# EAGLE design PWMExpansion (EAGLE 6.1)
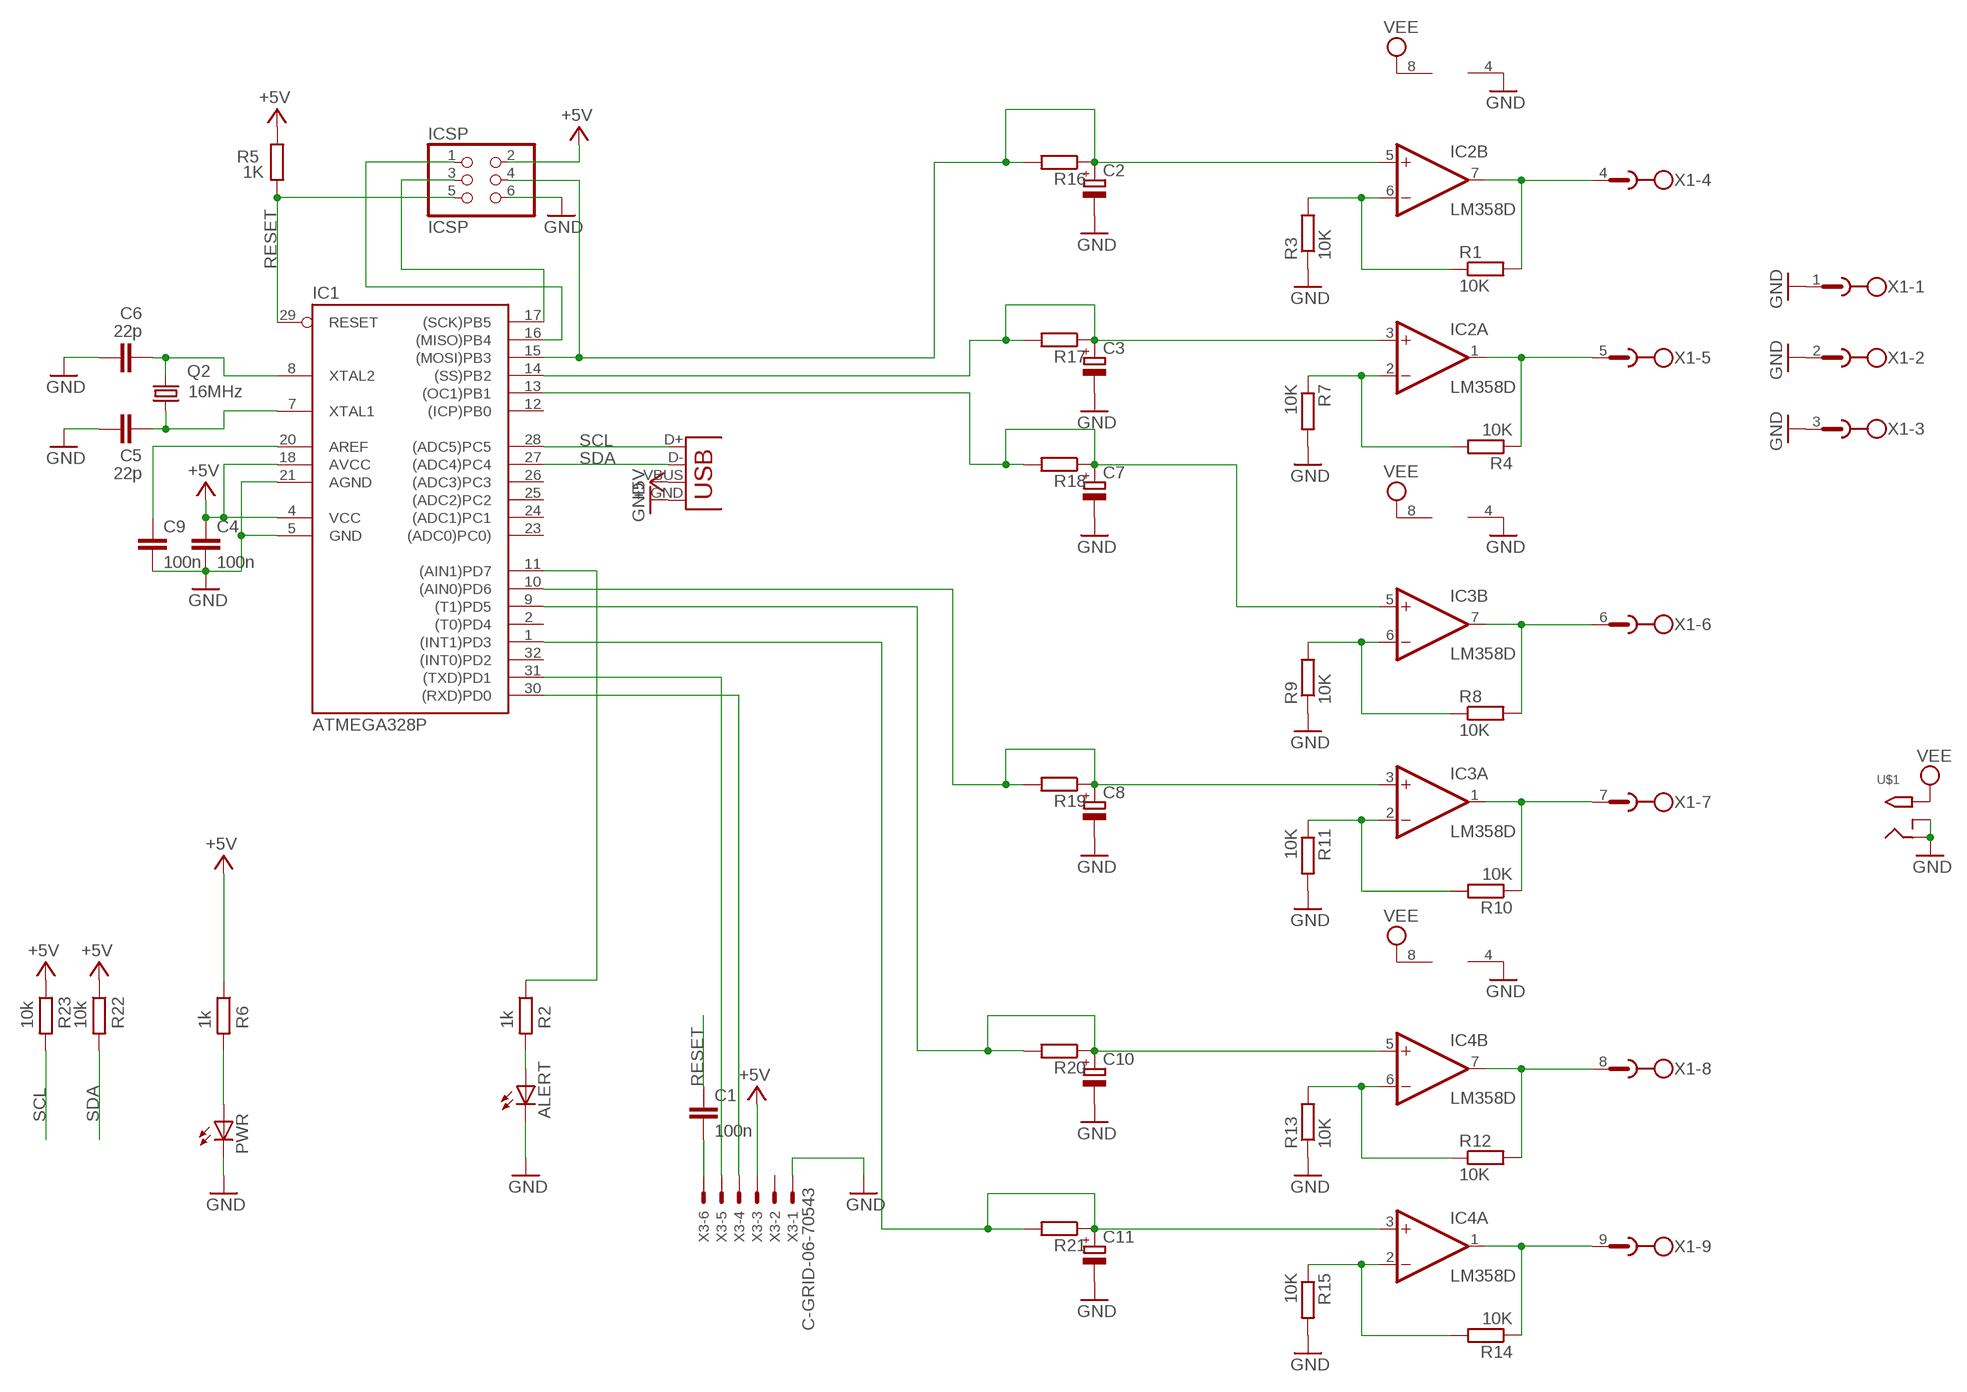
[diagram p0: schematic, sheet 1]

## Parts
ALERT  LED3MM  [LED3MM]
C1  100n  C-EUC0805  [C0805]
C2  CPOL-EUA/3216-18W  [A/3216-18W]
C3  CPOL-EUA/3216-18W  [A/3216-18W]
C4  100n  C-EUC0805  [C0805]
C5  22p  C-EUC0805  [C0805]
C6  22p  C-EUC0805  [C0805]
C7  CPOL-EUA/3216-18W  [A/3216-18W]
C8  CPOL-EUA/3216-18W  [A/3216-18W]
C9  100n  C-EUC0805  [C0805]
C10  CPOL-EUA/3216-18W  [A/3216-18W]
C11  CPOL-EUA/3216-18W  [A/3216-18W]
IC1  ATMEGA328P  AT90S4433A  [TQFP32-08]
IC2  LM358D  [SO08]
IC3  LM358D  [SO08]
IC4  LM358D  [SO08]
ICSP  ICSP  PINHD-2X3  [2X03]
PWR  LED3MM  [LED3MM]
Q2  16MHz  CRYTALHC49S  [HC49/S]
R1  10K  R-EU_R0805  [R0805]
R2  1k  R-EU_R0805  [R0805]
R3  10K  R-EU_R0805  [R0805]
R4  10K  R-EU_R0805  [R0805]
R5  1K  R-EU_R0805  [R0805]
R6  1k  R-EU_R0805  [R0805]
R7  10K  R-EU_R0805  [R0805]
R8  10K  R-EU_R0805  [R0805]
R9  10K  R-EU_R0805  [R0805]
R10  10K  R-EU_R0805  [R0805]
R11  10K  R-EU_R0805  [R0805]
R12  10K  R-EU_R0805  [R0805]
R13  10K  R-EU_R0805  [R0805]
R14  10K  R-EU_R0805  [R0805]
R15  10K  R-EU_R0805  [R0805]
R16  R-EU_R0805  [R0805]
R17  R-EU_R0805  [R0805]
R18  R-EU_R0805  [R0805]
R19  R-EU_R0805  [R0805]
R20  R-EU_R0805  [R0805]
R21  R-EU_R0805  [R0805]
R22  10k  R-EU_R0805  [R0805]
R23  10k  R-EU_R0805  [R0805]
U$1  2.1MMJACKTHM  [PJ-102A]
X1  MSTBV9  [MSTBV9]
X3  C-GRID-06-70543  [70543-06]
X5  USBSMD  [USB-MINIB]

## Nets
+5V: C4.1 IC1.4(VCC) IC1.18(AVCC) ICSP.2 R5.2 R6.1 R22.1 R23.1 X3.3 X5.VBUS
CTS: C1.2 X3.6
GND [gnd]: ALERT.K(C) C2.- C3.- C4.2 C5.1 C6.1 C7.- C8.- C9.2 C10.- C11.- IC1.5(GND) IC1.21(AGND) IC2.4(P:V-) IC3.4(P:V-) IC4.4(P:V-) ICSP.6 PWR.K(C) R3.1 R7.2 R9.1 R11.2 R13.1 R15.2 U$1.RING U$1.RING_SW X1.1 X1.2 X1.3 X3.1 X5.GND
MISO: IC1.16((MISO)PB4) ICSP.1
MOSI: C2.+ IC1.15((MOSI)PB3) IC2.5(B:+IN) ICSP.4 R16.1 R16.2
MOSI1: C7.+ IC1.13((OC1)PB1) IC3.5(B:+IN) R18.1 R18.2
MOSI2: C10.+ IC1.9((T1)PD5) IC4.5(B:+IN) R20.1 R20.2
N$1: C11.+ IC1.1((INT1)PD3) IC4.3(A:+IN) R21.1 R21.2
N$2: C8.+ IC1.10((AIN0)PD6) IC3.3(A:+IN) R19.1 R19.2
N$3: IC4.1(A:OUT) R14.1 X1.9
N$4: IC4.7(B:OUT) R12.2 X1.8
N$5: C3.+ IC1.14((SS)PB2) IC2.3(A:+IN) R17.1 R17.2
N$6: IC3.1(A:OUT) R10.1 X1.7
N$7: C5.2 IC1.7(XTAL1) Q2.1
N$8: IC3.6(B:-IN) R8.1 R9.2
N$9: C6.2 IC1.8(XTAL2) Q2.2
N$10: PWR.A R6.2
N$11: IC1.30((RXD)PD0) X3.4
N$12: IC1.31((TXD)PD1) X3.5
N$13: C9.1 IC1.20(AREF)
N$14: IC3.2(A:-IN) R10.2 R11.1
N$15: IC1.11((AIN1)PD7) R2.1
N$16: IC3.7(B:OUT) R8.2 X1.6
N$17: IC4.6(B:-IN) R12.1 R13.2
N$18: IC4.2(A:-IN) R14.2 R15.1
N$19: IC2.1(A:OUT) R4.1 X1.5
N$20: IC2.7(B:OUT) R1.2 X1.4
N$61: IC2.6(B:-IN) R1.1 R3.2
N$62: IC2.2(A:-IN) R4.2 R7.1
N$63: ALERT.A R2.2
RESET: C1.1 IC1.29(RESET) ICSP.5 R5.1
SCK: IC1.17((SCK)PB5) ICSP.3
SCL: IC1.28((ADC5)PC5) R23.2 X5.D+
SDA: IC1.27((ADC4)PC4) R22.2 X5.D-
VEE: IC2.8(P:V+) IC3.8(P:V+) IC4.8(P:V+) U$1.TIP
Unconnected: IC1.2((T0)PD4) IC1.12((ICP)PB0) IC1.23((ADC0)PC0)) IC1.24((ADC1)PC1) IC1.25((ADC2)PC2) IC1.26((ADC3)PC3) IC1.32((INT0)PD2) X3.2

## Library data of the parts
ALERT PWR = led:LED: LED OSRAM: - CHIPLED LG R971, LG N971, LY N971, LG Q971, LY Q971, LO R971, LY R971 LH N974, LH R974 LS Q976, LO Q976, LY Q976 LO Q996 - Hyper CHIPLED LW Q18S LB Q993, LB Q99A, LB R99A - SideLED LS A670, LO A670, LY A670, LG A670, LP A670 LB A673, LV A673, LT A673, LW A673 LH A674 LY A675 LS A676, LA A676, LO A676, LY A676, LW A676 LS A679, LY A679, LG A679 - Hyper Micro SIDELED® LS Y876, LA Y876, LO Y876, LY Y876 LT Y87S - SmartLED LW L88C, LW L88S LB L89C, LB L89S, LG L890 LS L89K, LO L89K, LY L89K LS L896, LA L896, LO L896, LY L896 - TOPLED LS T670, LO T670, LY T670, LG T670, LP T670 LSG T670, LSP T670, LSY T670, LOP T670, LYG T670 LG T671, LOG T671, LSG T671 LB T673, LV T673, LT T673, LW T673 LH T674 LS T676, LA T676, LO T676, LY T676, LB T676, LH T676, LSB T676, LW T676 LB T67C, LV T67C, LT T67C, LS T67K, LO T67K, LY T67K, LW E67C LS E67B, LA E67B, LO E67B, LY E67B, LB E67C, LV E67C, LT E67C LW T67C LS T679, LY T679, LG T679 LS T770, LO T770, LY T770, LG T770, LP T770 LB T773, LV T773, LT T773, LW T773 LH T774 LS E675, LA E675, LY E675, LS T675 LS T776, LA T776, LO T776, LY T776, LB T776 LHGB T686 LT T68C, LB T68C - Hyper Mini TOPLED® LB M676 - Mini TOPLED Santana® LG M470 LS M47K, LO M47K, LY M47K Source: http://www.osram.convergy.de LUXEON: - LUMILED® LXK2-PW12-R00, LXK2-PW12-S00, LXK2-PW14-U00, LXK2-PW14-V00 LXK2-PM12-R00, LXK2-PM12-S00, LXK2-PM14-U00 LXK2-PE12-Q00, LXK2-PE12-R00, LXK2-PE12-S00, LXK2-PE14-T00, LXK2-PE14-U00 LXK2-PB12-K00, LXK2-PB12-L00, LXK2-PB12-M00, LXK2-PB14-N00, LXK2-PB14-P00, LXK2-PB14-Q00 LXK2-PR12-L00, LXK2-PR12-M00, LXK2-PR14-Q00, LXK2-PR14-R00 LXK2-PD12-Q00, LXK2-PD12-R00, LXK2-PD12-S00 LXK2-PH12-R00, LXK2-PH12-S00 LXK2-PL12-P00, LXK2-PL12-Q00, LXK2-PL12-R00 Source: www.luxeon.com KINGBRIGHT: KA-3528ASYC Source: www.kingbright.com
C1 C4-C6 C9 = rcl:C-EU: CAPACITOR, European symbol
C2 C3 C7 C8 C10 C11 = rcl:CPOL-EU: POLARIZED CAPACITOR, European symbol
IC1 = atmel:AT90S4433: MICROCONTROLLER 4 Kbytes FLASH 128 bytes SRAM 256 bytes EEPROM UART 6-channel 10 bit ADC
IC2-IC4 = linear:LM358: OP AMP also LM158; LM258; LM2904 Source: http://cache.national.com/ds/LM/LM158.pdf
ICSP = pinhead:PINHD-2X3: PIN HEADER
Q2 = crystal:CRYTAL: CRYSTAL
R1-R23 = rcl:R-EU_: RESISTOR, European symbol
U$1 = adafruit:2.1MMJACK: 2.1mm x 5.5mm THM DC jack with internal switch. Digikey part #PJ-102A, 4UCON part #05537 2.1mm x 5.5mm SMT DC jack with internal switch. Digikey part #PJ-002A-SMT, 4UCON part #03267 By microbuilder.eu & adafruit.com
X1 = con-phoenix-508:MSTBV9: PHOENIX
X3 = con-molex:C-GRID-06: CONNECTOR wire to board 2.54 mm (0.100") pitch header
X5 = SparkFun:USB: USB Connectors USB-B-PTH is fully proven SKU : PRT-00139 USB-miniB is fully proven SKU : PRT-00587 USB-A-PCB is untested. USB-A-H is throughly reviewed, but untested. Spark Fun Electronics SKU : PRT-00437 USB-B-SMT is throughly reviewed, but untested. Needs silkscreen touching up. USB-A-S has not been used/tested USB-MB-H has not been used/tested

## Net classes
0 default: width 0.254 mm, drill 0.254 mm, clearance 0.203 mm
1 power: width 0.305 mm, drill 0.305 mm, clearance 0.203 mm
2 gnd: width 0.305 mm, drill 0.508 mm, clearance 0.203 mm

## Board
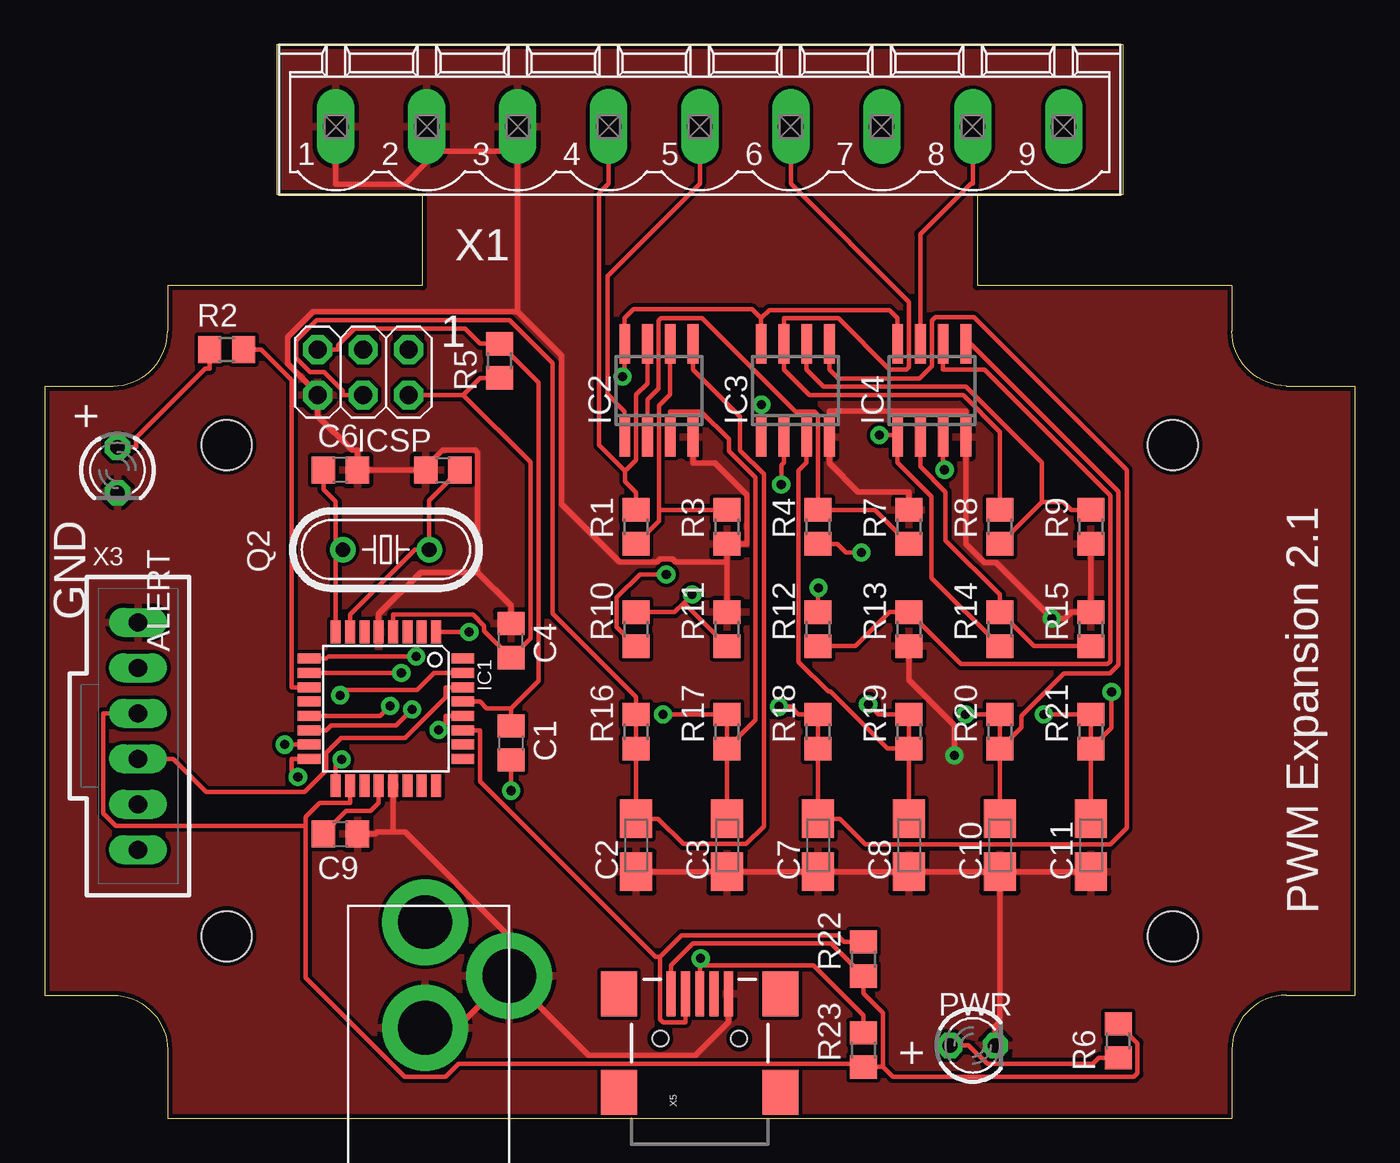
[diagram p1: board, top side]
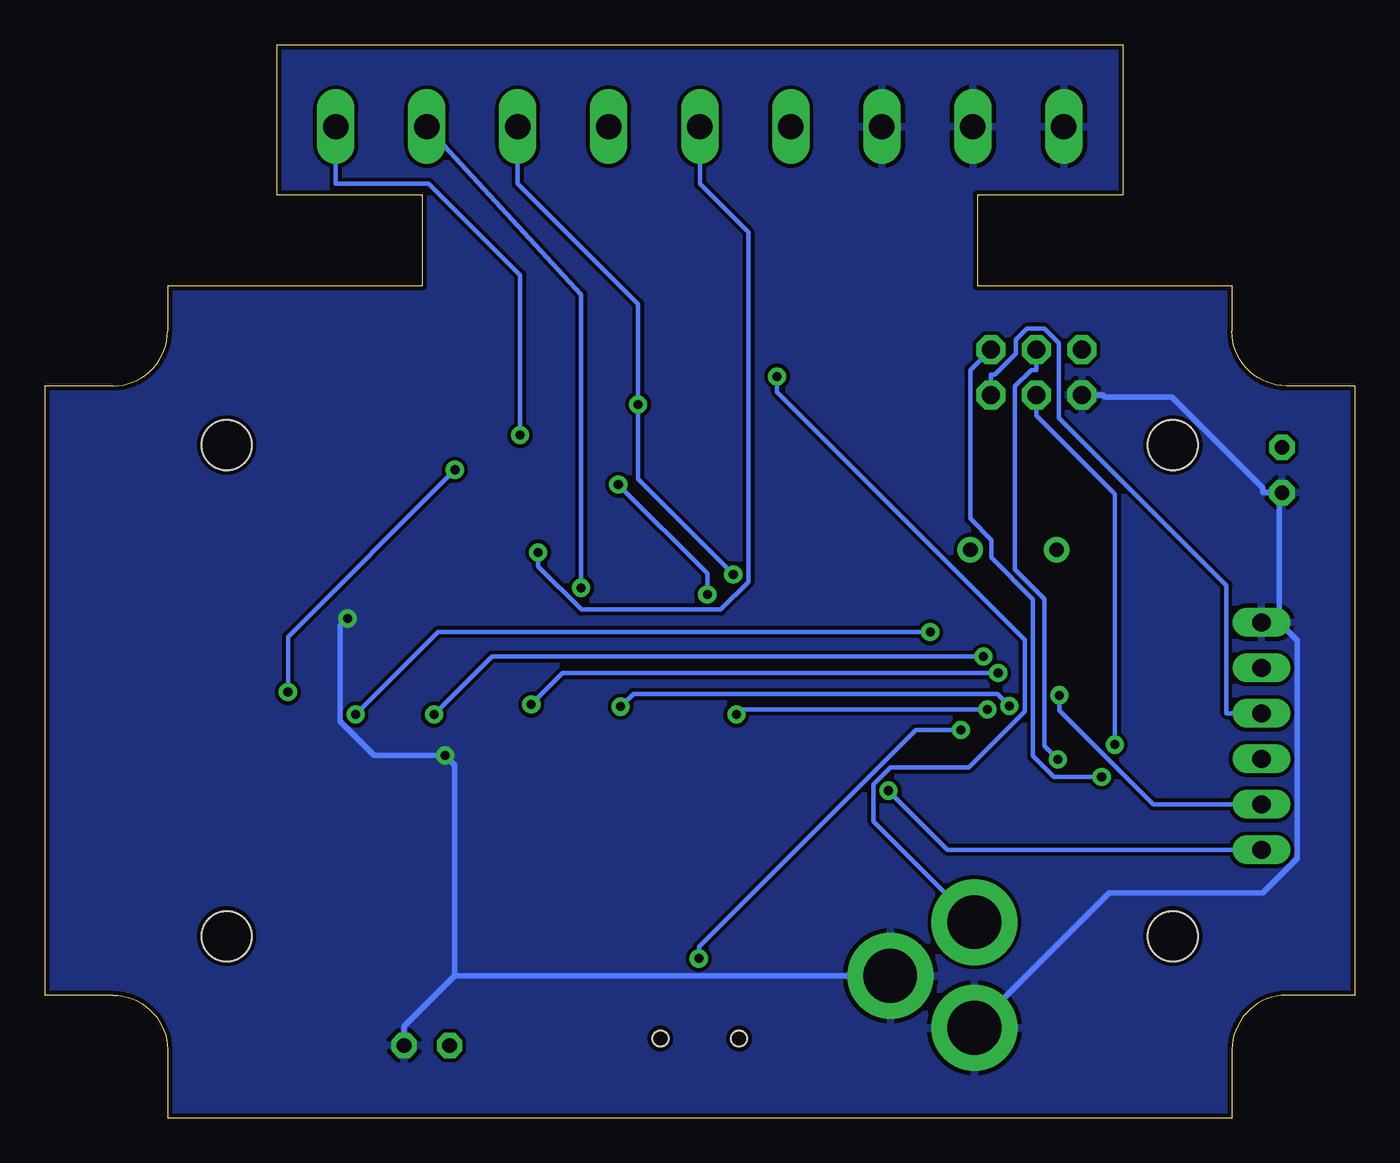
[diagram p2: board, bottom side, seen from below]

Size 73.15 x 59.94 mm. Coordinates in mm from the lower left corner, seen from the top.
Outline: 0,40.89 0,6.86 3.81,6.86 arc-90 6.86,3.81 6.86,0 66.29,0 66.29,3.81 arc-90 69.34,6.86 73.15,6.86 73.15,40.89 69.34,40.89 arc-90 66.29,43.94 66.29,46.48 52.07,46.48 52.07,51.56 60.2,51.56 60.2,59.94 12.95,59.94 12.95,51.56 21.08,51.56 21.08,46.48 6.86,46.48 6.86,43.94 arc-90 3.81,40.89 0,40.89
Copper layers (1*16): Top 0.035mm / dielectric 1.5mm / Bottom 0.035mm
Design rules: minimum track width 8mil, minimum drill 20mil, track to track 8mil, track to pad 8mil, pad to pad 8mil, via to via 8mil, smd to smd 8mil, copper to edge 10mil, drill to drill 8mil, minimum pad ring 12mil, minimum via ring 10mil, stop-mask expansion 4mil, vias tented up to drill 25mil, thermal gap 10mil
Holes 2.8 mm at 62.99,10.16 62.99,37.59 10.16,37.59 10.16,10.16

### Footprints (pad centres in the part's own frame; a part is rotated, then mirrored left to right if it is on the bottom)
LED3MM = drill 0.813 octagon: A -1.27,0; K 1.27,0
C0805 = smd 1.3 x 1.5: 1 -0.95,0; 2 0.95,0
A/3216-18W = smd 2.15 x 1.8: + 1.475,0; - -1.475,0
TQFP32-08 = smd 1.27 x 0.559: 1 -4.293,2.8; 2 -4.293,2; 3 -4.293,1.2; 4 -4.293,0.4; 5 -4.293,-0.4; 6 -4.293,-1.2; 7 -4.293,-2; 8 -4.293,-2.8; 17 4.293,-2.8; 18 4.293,-2; 19 4.293,-1.2; 20 4.293,-0.4; 21 4.293,0.4; 22 4.293,1.2; 23 4.293,2; 24 4.293,2.8 | smd 0.559 x 1.27: 9 -2.8,-4.293; 10 -2,-4.293; 11 -1.2,-4.293; 12 -0.4,-4.293; 13 0.4,-4.293; 14 1.2,-4.293; 15 2,-4.293; 16 2.8,-4.293; 25 2.8,4.293; 26 2,4.293; 27 1.2,4.293; 28 0.4,4.293; 29 -0.4,4.293; 30 -1.2,4.293; 31 -2,4.293; 32 -2.8,4.293
SO08 = smd 0.6 x 2.2: 1 -1.905,-2.6; 2 -0.635,-2.6; 3 0.635,-2.6; 4 1.905,-2.6; 5 1.905,2.6; 6 0.635,2.6; 7 -0.635,2.6; 8 -1.905,2.6
2X03 = drill 1.016 octagon: 1 -2.54,-1.27; 2 -2.54,1.27; 3 0,-1.27; 4 0,1.27; 5 2.54,-1.27; 6 2.54,1.27
HC49/S = drill 0.813: 1 -2.413,0; 2 2.413,0
R0805 = smd 1.3 x 1.5: 1 -0.95,0; 2 0.95,0
PJ-102A = drill 3 pad 4.8: RING 0.1,-3.39; RING_SW -4.6,-6.29; TIP 0.1,-9.29
MSTBV9 = drill 1.397 long: 1 -20.32,0; 2 -15.24,0; 3 -10.16,0; 4 -5.08,0; 5 0,0; 6 5.08,0; 7 10.16,0; 8 15.24,0; 9 20.32,0
70543-06 = drill 1.016 long: 1 -6.35,0; 2 -3.81,0; 3 -1.27,0; 4 1.27,0; 5 3.81,0; 6 6.35,0
USB-MINIB = smd 2.5 x 0.5: D+ 2.5,0; D- 2.5,0.8; GND 2.5,-1.6; ID 2.5,-0.8; VBUS 2.5,1.6 | smd 2.5 x 2: GND@1 -3,-4.5; GND@2 -3,4.5; GND@3 2.5,4.5; GND@4 2.5,-4.5 | hole 0.9: 0,2.2; 0,-2.2

### Placement (x,y rotation side)
ALERT  4.06,36.2 270 top
C1  26.04,20.95 270 top
C2  33.02,15.24 90 top
C3  38.1,15.24 90 top
C4  26.04,26.67 90 top
C5  22.23,36.2 0 top
C6  16.51,36.2 180 top
C7  43.18,15.24 90 top
C8  48.26,15.24 90 top
C9  16.51,15.88 0 top
C10  53.34,15.24 90 top
C11  58.42,15.24 90 top
IC1  19.05,22.86 270 top
IC2  34.29,40.64 0 top
IC3  41.91,40.64 0 top
IC4  49.53,40.64 0 top
ICSP  17.78,41.66 180 top
PWR  51.82,4.06 0 top
Q2  19.05,31.75 180 top
R1  33.02,33.02 90 top
R2  10.16,42.93 180 top
R3  38.1,33.02 90 top
R4  43.18,33.02 90 top
R5  25.4,42.29 270 top
R6  59.94,4.32 270 top
R7  48.26,33.02 90 top
R8  53.34,33.02 90 top
R9  58.42,33.02 90 top
R10  33.02,27.3 90 top
R11  38.1,27.3 90 top
R12  43.18,27.3 90 top
R13  48.26,27.3 90 top
R14  53.34,27.3 90 top
R15  58.42,27.3 90 top
R16  33.02,21.59 90 top
R17  38.1,21.59 90 top
R18  43.18,21.59 90 top
R19  48.26,21.59 90 top
R20  53.34,21.59 90 top
R21  58.42,21.59 90 top
R22  45.72,8.89 90 top
R23  45.72,3.81 90 top
U$1  21.34,1.65 180 top
X1  36.58,55.37 0 top
X3  5.21,21.34 270 top
X5  36.58,4.45 90 top

### Tracks (layer width: path | path; a pad name or v marks a point on that pad's centre or on a via)
+5V
  Top 0.254: X5.VBUS 34.98,8.53 36.2,9.75 43.91,9.75 R22.1 45.72,6.96 46.8,5.88 46.8,2.86 | 23.36,40.39 27.11,36.63 27.11,26.8 C4.1 24.54,27.21 24.54,27.49 23.92,28.12 19.45,28.12 IC1.4 | 23.36,40.39 24.32,41.34 R5.2 | ICSP.2 23.36,40.39 | 14.58,16.33 14.58,7.83 20.11,2.3 22.39,2.3 23.11,3.02 46.09,3.02 46.26,2.86 | 14.58,16.33 14.58,16.83 15.35,17.6 17.05,17.6 IC1.18 | 14.58,16.33 3.95,16.33 3.25,17.03 3.25,22.61 X3.3 | 46.8,2.86 47.36,2.3 60.83,2.3 61.02,2.5 61.02,4.19 R6.1 | 46.26,2.86 46.8,2.86 | R23.1 46.26,2.86
  Bottom 0.254: ICSP.2 20.32,41.53 20.08,41.53 18.92,42.69 18.92,43.48 18.31,44.09 17.32,44.09 16.51,43.28 16.51,39.1 7.16,29.75 7.16,22.61 X3.3
CTS  (via drill 0.51 pad 1.02)
  Top 0.254: v26.04,18.29 C1.2
  Bottom 0.254: X3.6 22.73,14.99 v26.04,18.29
GND  (via drill 0.51 pad 1.02)
  Top 0.305: 38.1,31.06 35.23,31.06 35.06,31.23 34.35,31.23 34.18,31.06 32.1,31.06 28.86,34.31 28.86,42.6 26.42,45.04 | C2.- 34.28,13.77 C3.- C7.- 44.44,13.77 C8.- C10.- | v50.8,20.26 50.8,21.94 48.26,24.48 48.26,25.35 R13.1 | 57.87,28.25 58.42,28.81 R9.1 | 57.87,28.25 57.31,28.25 56.96,27.9 v56.23,27.9 53.11,31.02 52.47,31.02 51.44,32.06 51.44,36.58 IC4.4 51.44,39.5 43.81,39.5 IC3.4 43.81,36.58 45.42,34.98 48.26,34.98 R7.2 | R15.2 57.87,28.25 | C10.- 57.16,13.77 C11.- | C10.- 53.34,5.38 53.09,5.13 PWR.K | R11.2 38.1,29.26 38.1,31.06 | U$1.RING_SW 30.37,3.51 36.34,3.51 38.18,5.34 X5.GND | U$1.RING_SW 23.04,5.04 U$1.RING | 24.18,30.48 26.04,28.63 C4.2 | 21.12,36.2 22.23,37.3 24.06,37.3 24.18,37.18 24.18,30.48 | 24.18,30.48 20.99,30.48 18.65,28.14 IC1.5 | 21.12,36.2 20.96,36.2 18.47,36.2 C6.1 17.46,37.3 17.16,37.3 15.24,39.22 ICSP.6 15.24,40.46 13.56,42.14 13.56,43.63 14.97,45.04 26.42,45.04 | C5.1 21.12,36.2 | U$1.RING_SW 25.94,10.16 20.11,15.98 19.45,15.98 | 19.45,15.98 18.57,15.98 18.47,15.88 C9.2 | IC1.21 19.45,15.98 | 26.42,45.04 26.42,52.16 26.42,54 | IC2.4 36.2,36.58 37.43,36.58 39.21,34.8 39.21,32.07 R3.1 38.1,31.06 | X1.3 26.42,54 | 21.34,54 26.42,54 | 21.34,54 21.34,53.38 20.11,52.16 16.26,52.16 X1.1 | X1.2 21.34,54
  Bottom 0.305: U$1.RING 13.71,12.57 5.15,12.57 3.21,14.51 3.21,26.68 4.22,27.69 | v56.23,27.9 56.66,27.48 56.66,22.16 54.76,20.26 v50.8,20.26 50.28,19.74 50.28,7.94 | 50.28,7.94 53.09,5.13 PWR.K | U$1.RING_SW 50.28,7.94 | ICSP.6 14.07,40.39 13.97,40.28 10.22,40.28 5.13,35.19 5.13,34.92 4.22,34.92 | ALERT.K 4.22,34.92 | X3.1 4.22,27.69 | 4.22,27.69 4.22,34.92
  pour Bottom: -1.27,63.5 74.93,63.5 74.93,-1.27 -1.27,-1.27
  pour Top: -1.27,62.23 74.93,62.23 74.93,-1.27 -1.27,-1.27
MISO  (via drill 0.51 pad 1.02)
  Top 0.254: v14.14,19.06 13.79,19.4 13.79,20.06 IC1.16
  Bottom 0.254: ICSP.1 21.47,41.78 21.47,33.47 20.29,32.3 20.29,31.3 17.96,28.98 17.96,20.22 16.8,19.06 v14.14,19.06
MOSI  (via drill 0.51 pad 1.02)
  Top 0.254: ICSP.4 16.64,40.39 16.64,40.62 15.6,41.66 14.83,41.66 14.05,42.44 14.05,43.43 15.17,44.55 25.97,44.55 28.36,42.16 28.36,28.18 33.02,23.52 R16.2 R16.1 C2.+ 34.25,16.71 35.66,15.31 39.17,15.31 40.16,16.3 40.16,35.96 38.82,37.29 38.82,39.19 36.2,41.81 IC2.5 | v13.4,20.86 13.79,20.86 IC1.15
  Bottom 0.254: v13.4,20.86 13.4,34.86 17.78,39.24 ICSP.4
MOSI1  (via drill 0.51 pad 1.02)
  Top 0.254: v19.29,23.02 18.72,22.46 15.72,22.46 IC1.13 | v41,22.98 41.66,22.98 42.1,22.54 R18.2 R18.1 C7.+ 44.41,16.71 45.84,15.29 59.5,15.29 60.41,16.2 60.41,36.2 51.89,44.73 49.73,44.73 49.53,44.53 49.53,42 48.85,41.31 44.31,41.31 43.81,41.81 IC3.5
  Bottom 0.254: v41,22.98 40.29,23.69 19.96,23.69 v19.29,23.02
MOSI2  (via drill 0.51 pad 1.02)
  Top 0.254: v20.73,25.78 15.84,25.78 15.72,25.66 IC1.9 | v51.42,22.54 R20.2 R20.1 | IC4.5 51.72,43.24 59.96,35.01 59.96,25.31 59.49,24.84 56.91,24.84 54.53,22.46 54.53,21.83 R20.1 | C10.+ R20.1
  Bottom 0.254: v51.42,22.54 48.18,25.77 v20.73,25.77 v20.73,25.78
N$1  (via drill 0.51 pad 1.02)
  Top 0.254: v55.8,22.54 R21.2 R21.1 | v23.7,27.14 IC1.1 | R21.1 59.58,21.8 v59.58,23.8 | R21.1 58.42,18.12 C11.+ | v50.25,36.21 50.16,36.29 IC4.3
  Bottom 0.254: v23.7,27.14 51.19,27.14 v55.8,22.54 | v59.58,23.8 59.58,26.88 v50.25,36.21
N$2  (via drill 0.51 pad 1.02)
  Top 0.254: IC1.10 v19.91,24.86 | R19.1 47.05,20.64 43.87,23.82 43.76,23.82 42.1,25.48 42.1,36.16 42.55,36.61 IC3.3 | C8.+ R19.1 | R19.1 R19.2 46.55,22.54 v45.99,23.1
  Bottom 0.254: v45.99,23.1 44.23,24.86 v19.91,24.86
N$3  (via drill 0.51 pad 1.02)
  Top 0.254: R14.1 49.52,30.17 49.52,34.71 47.62,36.61 IC4.1 47.52,38.14 v46.61,38.14
  Bottom 0.254: X1.9 56.9,52.18 51.72,52.18 46.61,47.08 v46.61,38.14
N$4  (via drill 0.51 pad 1.02)
  Top 0.254: v43.2,29.62 43.2,29.26 43.18,29.23 R12.2 | IC4.7 48.9,49.37 51.71,52.18 51.82,52.18 X1.8
  Bottom 0.254: X1.8 43.2,45.99 v43.2,29.62
N$5  (via drill 0.51 pad 1.02)
  Top 0.254: v20.51,22.82 19.61,21.93 15.99,21.93 15.72,21.66 IC1.14 | v34.53,22.54 R17.2 R17.1 | R17.1 39.7,22.24 39.7,35.77 38.2,37.27 38.2,37.91 36.64,39.47 34.92,39.47 IC2.3 | R17.1 38.1,18.12 C3.+
  Bottom 0.254: v20.51,22.82 34.25,22.82 v34.53,22.54
N$6  (via drill 0.51 pad 1.02)
  Top 0.254: v34.7,30.37 33.23,30.37 31.94,29.07 31.94,27.43 R10.1 | v40.02,39.85 40.01,39.84 40.01,39.47 IC3.1
  Bottom 0.254: v34.7,30.37 40.02,35.68 v40.02,39.85 40.02,45.46 46.74,52.18 X1.7
N$7
  Top 0.254: IC1.7 17.05,28.12 20.68,31.75 Q2.1 21.46,34.48 C5.2
N$8
  Top 0.254: 55.69,34.42 55.69,36.62 51.45,40.86 43.5,40.86 42.55,41.81 IC3.6 | 55.69,34.42 56.89,34.42 57.34,33.97 R9.2 | R8.1 55.69,34.42
N$9
  Top 0.254: 16.25,31.75 IC1.8 | 16.25,31.75 16.25,34.42 15.56,35.12 C6.2 | Q2.2 16.25,31.75
N$10
  Top 0.254: PWR.A 51.59,4.06 52.63,3.02 58.52,3.02 58.86,3.37 R6.2
N$11
  Top 0.254: IC1.30 22.38,24.06 22.38,23.49 20.12,21.24 16.56,21.24 15.72,20.4 15.72,19.43 14.5,18.21 9.02,18.21 7.16,20.07 X3.4
N$12  (via drill 0.51 pad 1.02)
  Top 0.254: v16.49,23.61 16.78,23.91 20.78,23.91 21.73,24.86 IC1.31
  Bottom 0.254: X3.5 11.25,17.53 16.49,22.76 v16.49,23.61
N$13
  Top 0.254: IC1.20 18.65,17.6 18.19,17.14 16.83,17.14 C9.1
N$14  (via drill 0.51 pad 1.02)
  Top 0.254: 35.69,28.77 v36.15,29.24 | 35.69,28.77 35.17,28.25 34.1,28.25 R10.2 | R11.1 35.69,28.77 | IC3.2 41.27,36.61 41.13,36.46 v41.13,35.38
  Bottom 0.254: v36.15,29.24 36.15,30.4 v41.13,35.38
N$15
  Top 0.254: IC1.11 13.79,24.06 13.79,41.22 12.09,42.93 R2.1
N$16
  Top 0.254: X1.6 41.66,52.18 48.26,45.59 48.26,41.94 48.13,41.81 47.17,41.81 44.31,44.67 41.27,44.67 IC3.7 41.27,41.81 42.71,40.38 51.29,40.38 53.34,38.32 R8.2
N$17
  Top 0.254: IC4.6 50.16,41.81 52.47,41.81 59.5,34.77 59.5,25.51 59.34,25.35 51.16,25.35 R13.2 47.83,28.25 47.18,28.25 45.28,26.36 R12.1
N$18
  Top 0.254: IC4.2 48.9,36.61 48.9,36.38 50.31,34.97 50.31,32.27 53.34,29.23 R14.2 55.24,26.36 R15.1
N$19  (via drill 0.51 pad 1.02)
  Top 0.254: IC2.1 32.38,39.47 31.42,40.43 31.42,47.03 36.58,52.18 X1.5 | R4.1 44.26,32.07 44.73,31.6 v45.6,31.6
  Bottom 0.254: v45.6,31.6 45.6,30.82 43.18,28.4 35.42,28.4 33.87,29.95 33.87,49.47 36.58,52.18 X1.5
N$20
  Top 0.254: 32.41,36.13 30.97,37.58 30.97,51.65 31.5,52.18 X1.4 | 32.41,36.13 33.02,36.74 33.02,40.4 33.66,41.03 33.66,41.81 IC2.7 | 32.41,36.13 32.41,35.56 33.02,34.95 R1.2
N$61
  Top 0.254: 34.29,33.97 34.29,39.78 34.92,40.42 IC2.6 | R1.1 34.29,33.34 34.29,33.97 | R3.2 34.29,33.97
N$62
  Top 0.254: IC2.2 33.66,39.47 33.66,40.12 34.28,40.75 34.28,44.53 34.42,44.67 36.71,44.67 41.91,39.47 42.98,39.47 43.18,39.27 R4.2 46.36,33.97 R7.1
N$63
  Top 0.254: ALERT.A 5.11,37.47 5.11,37.99 8.96,41.85 9.21,41.85 R2.2
RESET
  Top 0.254: ICSP.5 16.38,42.93 16.38,43.16 17.32,44.1 23.46,44.1 24.32,43.24 R5.1 27.57,41.07 27.57,24.42 26.04,22.89 | 26.04,22.89 24.68,22.89 24.31,23.26 IC1.29 | C1.1 26.04,22.89
SCK  (via drill 0.51 pad 1.02)
  Top 0.254: v16.57,20.03 16.25,19.71 IC1.17
  Bottom 0.254: v16.57,20.03 17.32,20.78 17.32,28.98 18.97,30.63 18.97,40.88 18.07,41.78 17.78,41.78 ICSP.3
SCL  (via drill 0.51 pad 1.02)
  Top 0.254: 36.63,8.53 42.94,8.53 45.72,5.74 R23.2 | v21.99,21.68 22.38,22.06 22.38,22.46 IC1.28 | 36.63,8.53 36.58,8.53 X5.D+ | 36.63,8.53 v36.63,8.91
  Bottom 0.254: v36.63,8.91 36.63,9.56 24.51,21.68 v21.99,21.68
SDA
  Top 0.254: 34.36,9 34.11,9 24.31,18.81 24.31,21.66 IC1.27 | 34.36,9 35.57,10.21 44.27,10.21 44.64,9.84 R22.2 | 34.36,9 34.36,5.53 34.52,5.37 35.78,5.37 X5.D-
VEE  (via drill 0.51 pad 1.02)
  Top 0.254: 40.01,44.67 39.51,45.17 32.88,45.17 32.38,44.67 IC2.8 32.38,41.81 32.26,41.69 v32.26,41.42 | 40.01,44.67 40.46,45.13 47.17,45.13 47.62,44.67 IC4.8 | IC3.8 40.01,44.67
  Bottom 0.254: U$1.TIP 26.87,16.58 26.87,18.64 25.92,19.59 21.54,19.59 18.42,22.7 18.42,26.71 32.26,40.55 v32.26,41.42

### Text on the board
tPlace: PWM Expansion 2.1
tNames: 1 | + | GND | +